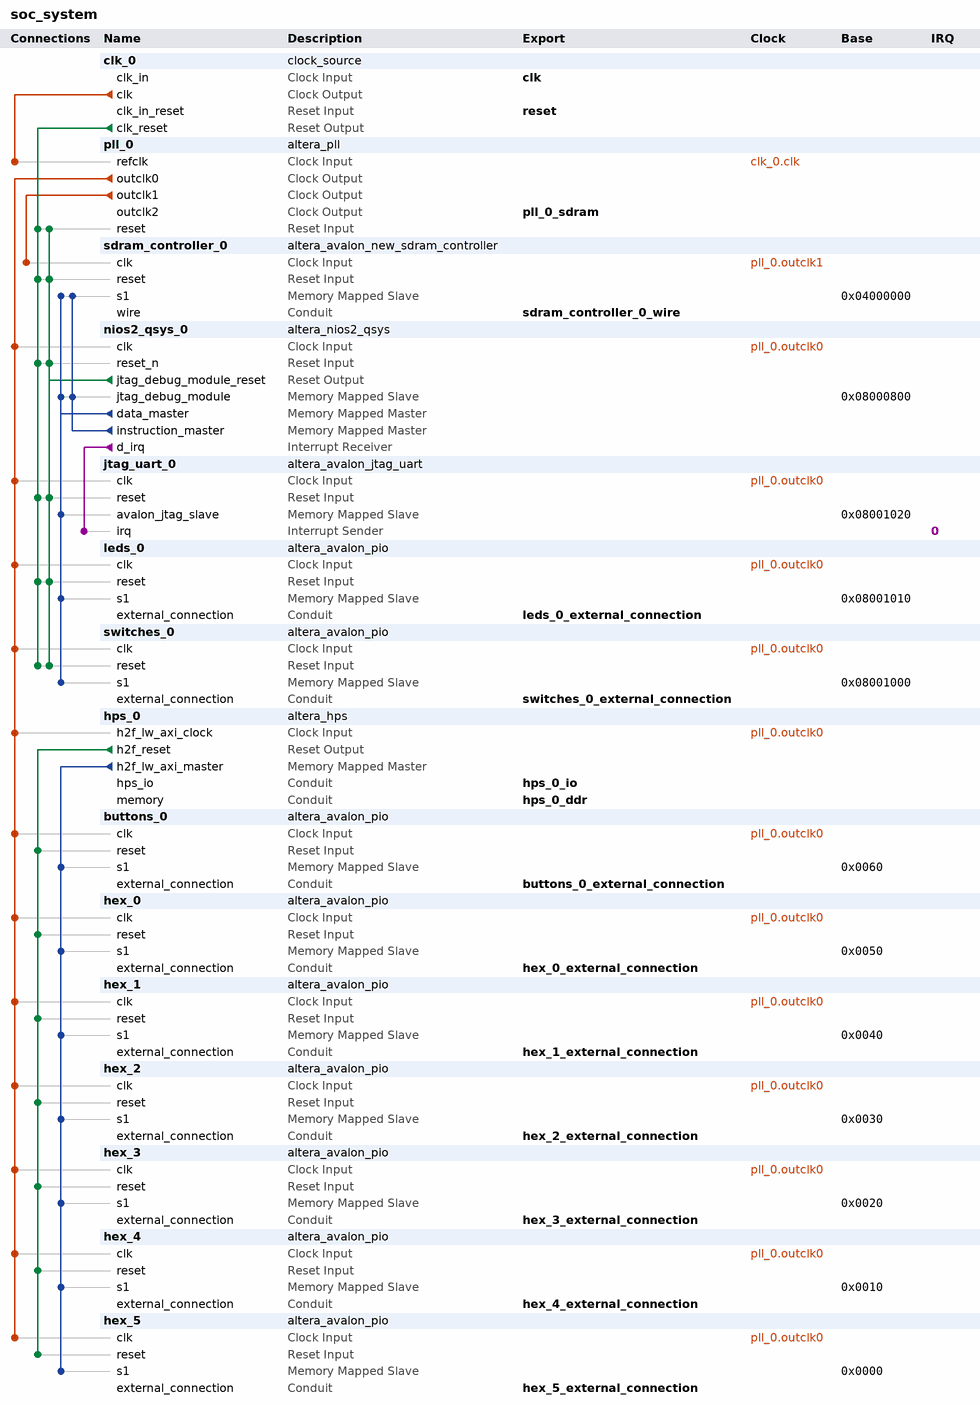
[diagram p0: system contents]
# Platform Designer (Qsys) system soc_system, Cyclone V 5CSEMA5F31C6
# Parameters at their usual value, and those the tool derives, are not listed.
package require -exact qsys 14.1
create_system soc_system
set_project_property DEVICE_FAMILY {Cyclone V}
set_project_property DEVICE 5CSEMA5F31C6

add_instance clk_0 clock_source 14.1
set_instance_parameter_value clk_0 clockFrequency 50000000

add_instance pll_0 altera_pll 14.1
set_instance_parameter_value pll_0 gui_device_speed_grade 1
set_instance_parameter_value pll_0 gui_number_of_clocks 3
set_instance_parameter_value pll_0 gui_operation_mode normal
set_instance_parameter_value pll_0 gui_output_clock_frequency0 50.0
set_instance_parameter_value pll_0 gui_output_clock_frequency1 100.0
set_instance_parameter_value pll_0 gui_output_clock_frequency2 100.0
set_instance_parameter_value pll_0 gui_phase_shift2 -3758
set_instance_parameter_value pll_0 gui_pll_mode {Integer-N PLL}
set_instance_parameter_value pll_0 gui_reference_clock_frequency 50.0
set_instance_parameter_value pll_0 gui_use_locked false

add_instance sdram_controller_0 altera_avalon_new_sdram_controller 14.1
set_instance_parameter_value sdram_controller_0 TAC 5.4
set_instance_parameter_value sdram_controller_0 TRCD 15.0
set_instance_parameter_value sdram_controller_0 TRP 15.0
set_instance_parameter_value sdram_controller_0 casLatency 3
set_instance_parameter_value sdram_controller_0 columnWidth 10
set_instance_parameter_value sdram_controller_0 dataWidth 16
set_instance_parameter_value sdram_controller_0 generateSimulationModel false
set_instance_parameter_value sdram_controller_0 model single_Micron_MT48LC4M32B2_7_chip
set_instance_parameter_value sdram_controller_0 numberOfBanks 4
set_instance_parameter_value sdram_controller_0 numberOfChipSelects 1
set_instance_parameter_value sdram_controller_0 powerUpDelay 100.0
set_instance_parameter_value sdram_controller_0 refreshPeriod 7.8125
set_instance_parameter_value sdram_controller_0 rowWidth 13

add_instance nios2_qsys_0 altera_nios2_qsys 14.1
set_instance_parameter_value nios2_qsys_0 breakSlave nios2_qsys_0.jtag_debug_module
set_instance_parameter_value nios2_qsys_0 exceptionSlave sdram_controller_0.s1
set_instance_parameter_value nios2_qsys_0 icache_size 4096
set_instance_parameter_value nios2_qsys_0 impl Fast
set_instance_parameter_value nios2_qsys_0 mmu_TLBMissExcSlave None
set_instance_parameter_value nios2_qsys_0 resetSlave sdram_controller_0.s1
set_instance_parameter_value nios2_qsys_0 resetrequest_enabled true

add_instance jtag_uart_0 altera_avalon_jtag_uart 14.1
set_instance_parameter_value jtag_uart_0 simInteractiveOptions NO_INTERACTIVE_WINDOWS

add_instance leds_0 altera_avalon_pio 14.1
set_instance_parameter_value leds_0 direction Output
set_instance_parameter_value leds_0 width 10

add_instance switches_0 altera_avalon_pio 14.1
set_instance_parameter_value switches_0 direction Input
set_instance_parameter_value switches_0 width 10

add_instance hps_0 altera_hps 14.1
set_instance_parameter_value hps_0 EMAC1_Mode N/A
set_instance_parameter_value hps_0 EMAC1_PinMuxing Unused
set_instance_parameter_value hps_0 F2SCLK_COLDRST_Enable false
set_instance_parameter_value hps_0 F2SCLK_DBGRST_Enable false
set_instance_parameter_value hps_0 F2SCLK_WARMRST_Enable false
set_instance_parameter_value hps_0 F2SINTERRUPT_Enable false
set_instance_parameter_value hps_0 F2S_Width 0
set_instance_parameter_value hps_0 FPGA_PERIPHERAL_OUTPUT_CLOCK_FREQ_EMAC0_GTX_CLK 100
set_instance_parameter_value hps_0 FPGA_PERIPHERAL_OUTPUT_CLOCK_FREQ_EMAC0_MD_CLK 100
set_instance_parameter_value hps_0 FPGA_PERIPHERAL_OUTPUT_CLOCK_FREQ_EMAC1_GTX_CLK 100
set_instance_parameter_value hps_0 FPGA_PERIPHERAL_OUTPUT_CLOCK_FREQ_EMAC1_MD_CLK 100
set_instance_parameter_value hps_0 HPS_PROTOCOL DDR3
set_instance_parameter_value hps_0 I2C0_Mode N/A
set_instance_parameter_value hps_0 I2C0_PinMuxing Unused
set_instance_parameter_value hps_0 I2C1_Mode N/A
set_instance_parameter_value hps_0 I2C1_PinMuxing Unused
set_instance_parameter_value hps_0 LWH2F_Enable true
set_instance_parameter_value hps_0 MEM_BANKADDR_WIDTH 3
set_instance_parameter_value hps_0 MEM_CLK_FREQ 400.0
set_instance_parameter_value hps_0 MEM_COL_ADDR_WIDTH 10
set_instance_parameter_value hps_0 MEM_DQ_WIDTH 32
set_instance_parameter_value hps_0 MEM_DRV_STR RZQ/7
set_instance_parameter_value hps_0 MEM_ROW_ADDR_WIDTH 15
set_instance_parameter_value hps_0 MEM_RTT_NOM RZQ/4
set_instance_parameter_value hps_0 MEM_RTT_WR RZQ/4
set_instance_parameter_value hps_0 MEM_TCL 11
set_instance_parameter_value hps_0 MEM_TFAW_NS 30.0
set_instance_parameter_value hps_0 MEM_TRAS_NS 35.0
set_instance_parameter_value hps_0 MEM_TRCD_NS 13.75
set_instance_parameter_value hps_0 MEM_TRFC_NS 260.0
set_instance_parameter_value hps_0 MEM_TRP_NS 13.75
set_instance_parameter_value hps_0 MEM_VENDOR Micron
set_instance_parameter_value hps_0 MEM_WTCL 8
set_instance_parameter_value hps_0 QSPI_Mode N/A
set_instance_parameter_value hps_0 QSPI_PinMuxing Unused
set_instance_parameter_value hps_0 REF_CLK_FREQ 25.0
set_instance_parameter_value hps_0 S2F_Width 0
set_instance_parameter_value hps_0 SDIO_Mode N/A
set_instance_parameter_value hps_0 SDIO_PinMuxing Unused
set_instance_parameter_value hps_0 SPIM1_Mode N/A
set_instance_parameter_value hps_0 SPIM1_PinMuxing Unused
set_instance_parameter_value hps_0 STM_Enable false
set_instance_parameter_value hps_0 TIMING_BOARD_AC_SKEW 0.02
set_instance_parameter_value hps_0 TIMING_BOARD_AC_TO_CK_SKEW 0.01
set_instance_parameter_value hps_0 TIMING_BOARD_DQ_TO_DQS_SKEW 0.05
set_instance_parameter_value hps_0 TIMING_BOARD_MAX_CK_DELAY 0.03
set_instance_parameter_value hps_0 TIMING_BOARD_MAX_DQS_DELAY 0.02
set_instance_parameter_value hps_0 TIMING_BOARD_SKEW_BETWEEN_DQS 0.06
set_instance_parameter_value hps_0 TIMING_BOARD_SKEW_CKDQS_DIMM_MAX 0.12
set_instance_parameter_value hps_0 TIMING_BOARD_SKEW_CKDQS_DIMM_MIN 0.06
set_instance_parameter_value hps_0 TIMING_BOARD_SKEW_WITHIN_DQS 0.01
set_instance_parameter_value hps_0 TIMING_TDH 65
set_instance_parameter_value hps_0 TIMING_TDQSCK 255
set_instance_parameter_value hps_0 TIMING_TDQSQ 125
set_instance_parameter_value hps_0 TIMING_TDS 30
set_instance_parameter_value hps_0 TIMING_TIH 140
set_instance_parameter_value hps_0 TIMING_TIS 180
set_instance_parameter_value hps_0 TIMING_TQSH 0.4
set_instance_parameter_value hps_0 UART0_Mode N/A
set_instance_parameter_value hps_0 UART0_PinMuxing Unused
set_instance_parameter_value hps_0 USB1_Mode N/A
set_instance_parameter_value hps_0 USB1_PinMuxing Unused
set_instance_parameter_value hps_0 desired_cfg_clk_mhz 100.0
set_instance_parameter_value hps_0 desired_qspi_clk_mhz 400.0

add_instance buttons_0 altera_avalon_pio 14.1
set_instance_parameter_value buttons_0 direction Input
set_instance_parameter_value buttons_0 width 4

add_instance hex_0 altera_avalon_pio 14.1
set_instance_parameter_value hex_0 direction Output
set_instance_parameter_value hex_0 resetValue 127
set_instance_parameter_value hex_0 width 7

add_instance hex_1 altera_avalon_pio 14.1
set_instance_parameter_value hex_1 direction Output
set_instance_parameter_value hex_1 resetValue 127
set_instance_parameter_value hex_1 width 7

add_instance hex_2 altera_avalon_pio 14.1
set_instance_parameter_value hex_2 direction Output
set_instance_parameter_value hex_2 resetValue 127
set_instance_parameter_value hex_2 width 7

add_instance hex_3 altera_avalon_pio 14.1
set_instance_parameter_value hex_3 direction Output
set_instance_parameter_value hex_3 resetValue 127
set_instance_parameter_value hex_3 width 7

add_instance hex_4 altera_avalon_pio 14.1
set_instance_parameter_value hex_4 direction Output
set_instance_parameter_value hex_4 resetValue 127
set_instance_parameter_value hex_4 width 7

add_instance hex_5 altera_avalon_pio 14.1
set_instance_parameter_value hex_5 direction Output
set_instance_parameter_value hex_5 resetValue 127
set_instance_parameter_value hex_5 width 7

# connections
add_connection clk_0.clk pll_0.refclk clock
add_connection pll_0.outclk0 buttons_0.clk clock
add_connection pll_0.outclk0 hex_0.clk clock
add_connection pll_0.outclk0 hex_1.clk clock
add_connection pll_0.outclk0 hex_2.clk clock
add_connection pll_0.outclk0 hex_3.clk clock
add_connection pll_0.outclk0 hex_4.clk clock
add_connection pll_0.outclk0 hex_5.clk clock
add_connection pll_0.outclk0 hps_0.h2f_lw_axi_clock clock
add_connection pll_0.outclk0 jtag_uart_0.clk clock
add_connection pll_0.outclk0 leds_0.clk clock
add_connection pll_0.outclk0 nios2_qsys_0.clk clock
add_connection pll_0.outclk0 switches_0.clk clock
add_connection pll_0.outclk1 sdram_controller_0.clk clock
add_connection clk_0.clk_reset jtag_uart_0.reset reset
add_connection clk_0.clk_reset leds_0.reset reset
add_connection clk_0.clk_reset nios2_qsys_0.reset_n reset
add_connection clk_0.clk_reset pll_0.reset reset
add_connection clk_0.clk_reset sdram_controller_0.reset reset
add_connection clk_0.clk_reset switches_0.reset reset
add_connection hps_0.h2f_reset buttons_0.reset reset
add_connection hps_0.h2f_reset hex_0.reset reset
add_connection hps_0.h2f_reset hex_1.reset reset
add_connection hps_0.h2f_reset hex_2.reset reset
add_connection hps_0.h2f_reset hex_3.reset reset
add_connection hps_0.h2f_reset hex_4.reset reset
add_connection hps_0.h2f_reset hex_5.reset reset
add_connection nios2_qsys_0.jtag_debug_module_reset jtag_uart_0.reset reset
add_connection nios2_qsys_0.jtag_debug_module_reset leds_0.reset reset
add_connection nios2_qsys_0.jtag_debug_module_reset nios2_qsys_0.reset_n reset
add_connection nios2_qsys_0.jtag_debug_module_reset pll_0.reset reset
add_connection nios2_qsys_0.jtag_debug_module_reset sdram_controller_0.reset reset
add_connection nios2_qsys_0.jtag_debug_module_reset switches_0.reset reset
add_connection hps_0.h2f_lw_axi_master buttons_0.s1 avalon
set_connection_parameter_value hps_0.h2f_lw_axi_master/buttons_0.s1 baseAddress 0x0060
add_connection hps_0.h2f_lw_axi_master hex_0.s1 avalon
set_connection_parameter_value hps_0.h2f_lw_axi_master/hex_0.s1 baseAddress 0x0050
add_connection hps_0.h2f_lw_axi_master hex_1.s1 avalon
set_connection_parameter_value hps_0.h2f_lw_axi_master/hex_1.s1 baseAddress 0x0040
add_connection hps_0.h2f_lw_axi_master hex_2.s1 avalon
set_connection_parameter_value hps_0.h2f_lw_axi_master/hex_2.s1 baseAddress 0x0030
add_connection hps_0.h2f_lw_axi_master hex_3.s1 avalon
set_connection_parameter_value hps_0.h2f_lw_axi_master/hex_3.s1 baseAddress 0x0020
add_connection hps_0.h2f_lw_axi_master hex_4.s1 avalon
set_connection_parameter_value hps_0.h2f_lw_axi_master/hex_4.s1 baseAddress 0x0010
add_connection hps_0.h2f_lw_axi_master hex_5.s1 avalon
set_connection_parameter_value hps_0.h2f_lw_axi_master/hex_5.s1 baseAddress 0x0000
add_connection nios2_qsys_0.data_master jtag_uart_0.avalon_jtag_slave avalon
set_connection_parameter_value nios2_qsys_0.data_master/jtag_uart_0.avalon_jtag_slave baseAddress 0x08001020
add_connection nios2_qsys_0.data_master leds_0.s1 avalon
set_connection_parameter_value nios2_qsys_0.data_master/leds_0.s1 baseAddress 0x08001010
add_connection nios2_qsys_0.data_master nios2_qsys_0.jtag_debug_module avalon
set_connection_parameter_value nios2_qsys_0.data_master/nios2_qsys_0.jtag_debug_module baseAddress 0x08000800
add_connection nios2_qsys_0.data_master sdram_controller_0.s1 avalon
set_connection_parameter_value nios2_qsys_0.data_master/sdram_controller_0.s1 baseAddress 0x04000000
add_connection nios2_qsys_0.data_master switches_0.s1 avalon
set_connection_parameter_value nios2_qsys_0.data_master/switches_0.s1 baseAddress 0x08001000
add_connection nios2_qsys_0.instruction_master nios2_qsys_0.jtag_debug_module avalon
set_connection_parameter_value nios2_qsys_0.instruction_master/nios2_qsys_0.jtag_debug_module baseAddress 0x08000800
add_connection nios2_qsys_0.instruction_master sdram_controller_0.s1 avalon
set_connection_parameter_value nios2_qsys_0.instruction_master/sdram_controller_0.s1 baseAddress 0x04000000
add_connection nios2_qsys_0.d_irq jtag_uart_0.irq interrupt
set_connection_parameter_value nios2_qsys_0.d_irq/jtag_uart_0.irq irqNumber 0

# exported interfaces
add_interface buttons_0_external_connection conduit end
set_interface_property buttons_0_external_connection EXPORT_OF buttons_0.external_connection
add_interface clk clock sink
set_interface_property clk EXPORT_OF clk_0.clk_in
add_interface hex_0_external_connection conduit end
set_interface_property hex_0_external_connection EXPORT_OF hex_0.external_connection
add_interface hex_1_external_connection conduit end
set_interface_property hex_1_external_connection EXPORT_OF hex_1.external_connection
add_interface hex_2_external_connection conduit end
set_interface_property hex_2_external_connection EXPORT_OF hex_2.external_connection
add_interface hex_3_external_connection conduit end
set_interface_property hex_3_external_connection EXPORT_OF hex_3.external_connection
add_interface hex_4_external_connection conduit end
set_interface_property hex_4_external_connection EXPORT_OF hex_4.external_connection
add_interface hex_5_external_connection conduit end
set_interface_property hex_5_external_connection EXPORT_OF hex_5.external_connection
add_interface hps_0_ddr conduit end
set_interface_property hps_0_ddr EXPORT_OF hps_0.memory
add_interface hps_0_io conduit end
set_interface_property hps_0_io EXPORT_OF hps_0.hps_io
add_interface leds_0_external_connection conduit end
set_interface_property leds_0_external_connection EXPORT_OF leds_0.external_connection
add_interface pll_0_sdram clock source
set_interface_property pll_0_sdram EXPORT_OF pll_0.outclk2
add_interface reset reset sink
set_interface_property reset EXPORT_OF clk_0.clk_in_reset
add_interface sdram_controller_0_wire conduit end
set_interface_property sdram_controller_0_wire EXPORT_OF sdram_controller_0.wire
add_interface switches_0_external_connection conduit end
set_interface_property switches_0_external_connection EXPORT_OF switches_0.external_connection

set_interconnect_requirement {$system} qsys_mm.clockCrossingAdapter HANDSHAKE
set_interconnect_requirement {$system} qsys_mm.insertDefaultSlave FALSE
set_interconnect_requirement {$system} qsys_mm.maxAdditionalLatency 1

save_system soc_system.qsys
